# Altium schematic sheet SoC_Jtag.SchDoc
size A4; SheetNumber: 22; SheetTotal: 22
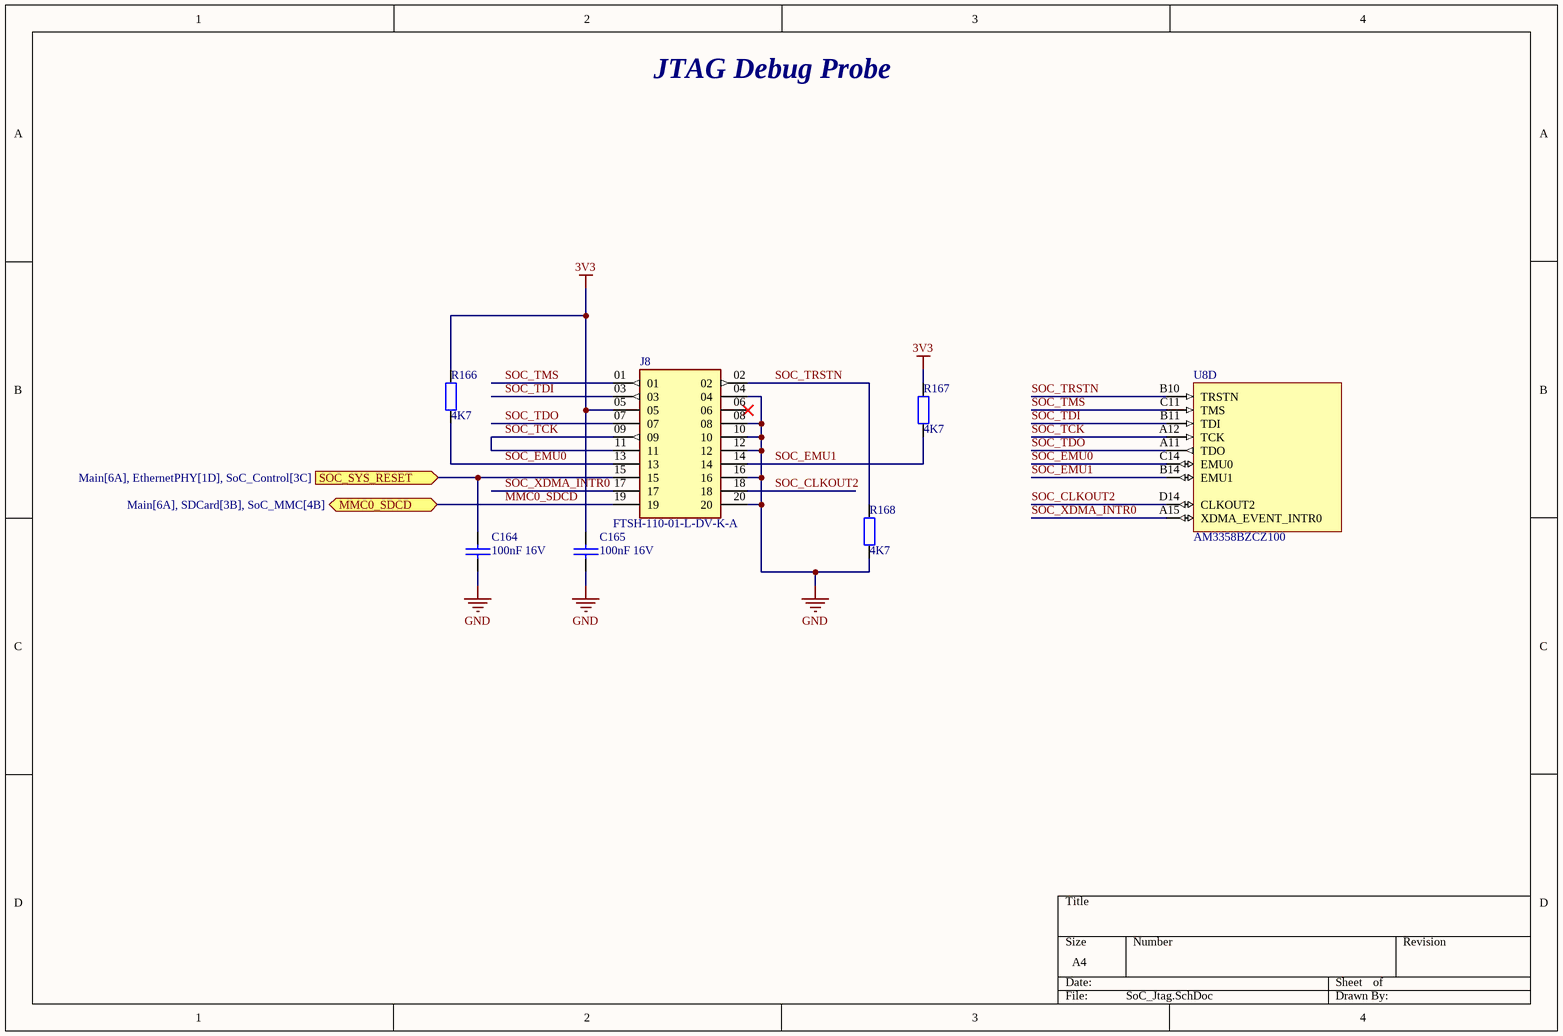
[diagram p0: SoC_Jtag.SchDoc]

## Parts
C164  100nF 16V  [C_0402]
C165  100nF 16V  [C_0402]
J8  FTSH-110-01-L-DV-K-A  [FTSH-110-01-L-DV-K-A]
R166  4K7  [R_0402]
R167  4K7  [R_0402]
R168  4K7  [R_0402]
U8  AM3358BZCZ100  [BGA324C80P18X18_1500X1500X140]  (part D of 9)

## Ports
MMC0_SDCD (bidir, see Main[6A], SDCard[3B], SoC_MMC[4B]), SOC_SYS_RESET (in, see Main[6A], EthernetPHY[1D], SoC_Control[3C])

## Nets
3V3: C165.1 J8.05 R166.2 R167.2
GND: C164.2 C165.2 J8.04 J8.08 J8.10 J8.12 J8.16 J8.20 R168.1
MMC0_SDCD: J8.19 ; port MMC0_SDCD
SOC_CLKOUT2: J8.18 U8.D14(CLKOUT2)
SOC_EMU0: J8.13 R166.1 U8.C14(EMU0)
SOC_EMU1: J8.14 R167.1 U8.B14(EMU1)
SOC_SYS_RESET: C164.1 J8.15 ; port SOC_SYS_RESET
SOC_TCK: J8.09 J8.11 U8.A12(TCK)
SOC_TDI: J8.03 U8.B11(TDI)
SOC_TDO: J8.07 U8.A11(TDO)
SOC_TMS: J8.01 U8.C11(TMS)
SOC_TRSTN: J8.02 R168.2 U8.B10(TRSTN)
SOC_XDMA_INTR0: J8.17 U8.A15(XDMA_EVENT_INTR0)

Not connected (* = marked no-connect by the designer): J8 06*

## Notes on the sheet
- JTAG Debug Probe

## Library data of the parts
C164 C165 = C_0402: Capacitor 0402 SMD
J8 = FTSH-110-01-L-DV-K-A: Connector Header Surface Mount 20 position 0.050" (1.27mm)
R166-R168 = R_0402: Resistor 0402 SMD
U8 = AM3358BZCZ100: ARM-ASeries 1GHz NFBGA-324 Microcontrollers (MCU/MPU/SOC) ROHS; Manufacturer: Texas Instruments; Manufacturer Part Number: AM3358BZCZ100; Datasheet Link: https://www.ti.com/lit/ds/symlink/am3358.pdf